# Altium schematic sheet do.SchDoc
size A2
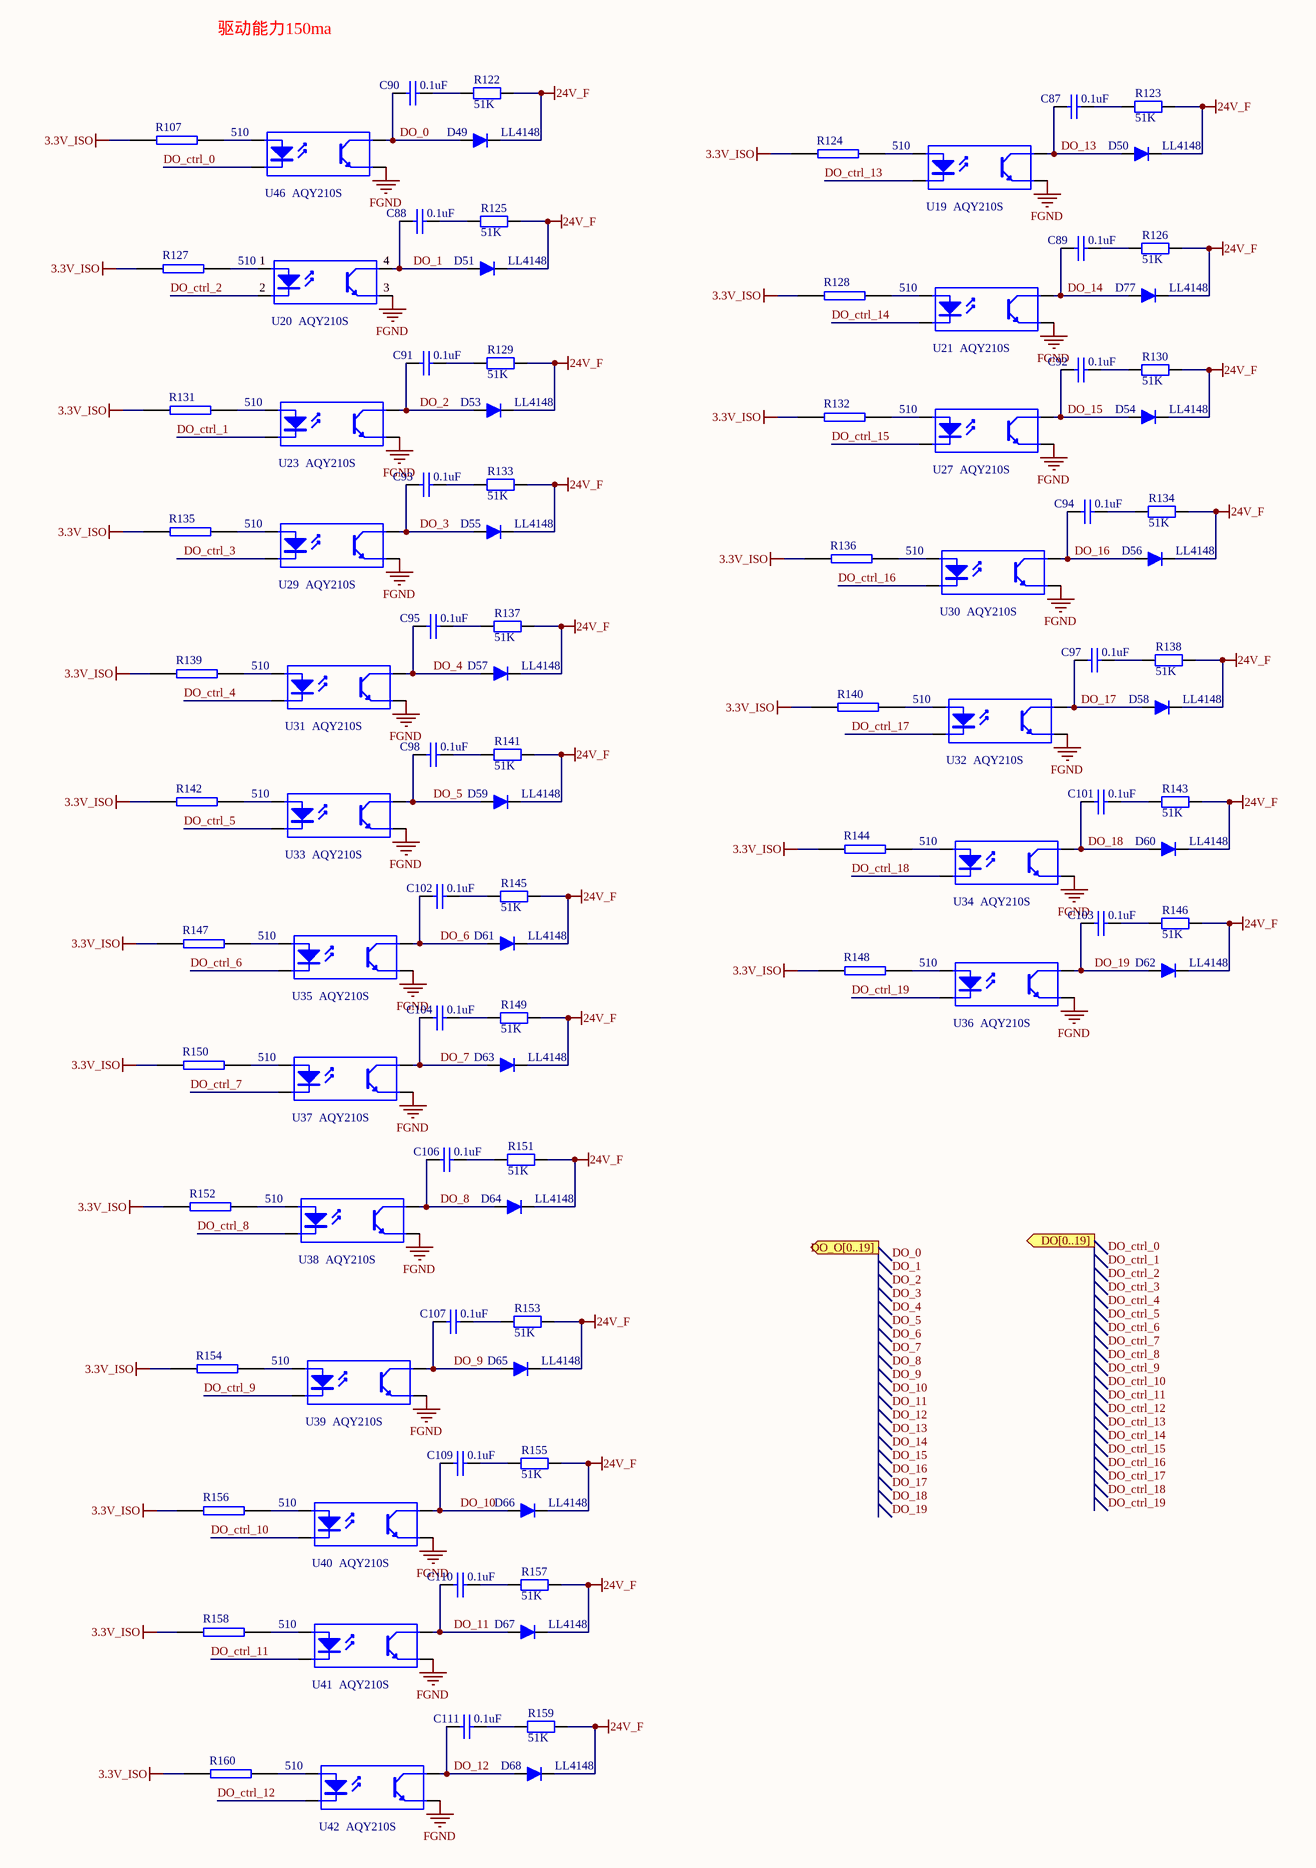
[diagram p0: do.SchDoc]

## Parts
C87  0.1uF  [0603C]
C88  0.1uF  [0603C]
C89  0.1uF  [0603C]
C90  0.1uF  [0603C]
C91  0.1uF  [0603C]
C92  0.1uF  [0603C]
C93  0.1uF  [0603C]
C94  0.1uF  [0603C]
C95  0.1uF  [0603C]
C97  0.1uF  [0603C]
C98  0.1uF  [0603C]
C101  0.1uF  [0603C]
C102  0.1uF  [0603C]
C103  0.1uF  [0603C]
C104  0.1uF  [0603C]
C106  0.1uF  [0603C]
C107  0.1uF  [0603C]
C109  0.1uF  [0603C]
C110  0.1uF  [0603C]
C111  0.1uF  [0603C]
D49  LL4148  [DO-213AB/LL34/MiniMELF]
D50  LL4148  [DO-213AB/LL34/MiniMELF]
D51  LL4148  [DO-213AB/LL34/MiniMELF]
D53  LL4148  [DO-213AB/LL34/MiniMELF]
D54  LL4148  [DO-213AB/LL34/MiniMELF]
D55  LL4148  [DO-213AB/LL34/MiniMELF]
D56  LL4148  [DO-213AB/LL34/MiniMELF]
D57  LL4148  [DO-213AB/LL34/MiniMELF]
D58  LL4148  [DO-213AB/LL34/MiniMELF]
D59  LL4148  [DO-213AB/LL34/MiniMELF]
D60  LL4148  [DO-213AB/LL34/MiniMELF]
D61  LL4148  [DO-213AB/LL34/MiniMELF]
D62  LL4148  [DO-213AB/LL34/MiniMELF]
D63  LL4148  [DO-213AB/LL34/MiniMELF]
D64  LL4148  [DO-213AB/LL34/MiniMELF]
D65  LL4148  [DO-213AB/LL34/MiniMELF]
D66  LL4148  [DO-213AB/LL34/MiniMELF]
D67  LL4148  [DO-213AB/LL34/MiniMELF]
D68  LL4148  [DO-213AB/LL34/MiniMELF]
D77  LL4148  [DO-213AB/LL34/MiniMELF]
R107  510  [0603R]
R122  51K  [0603R]
R123  51K  [0603R]
R124  510  [0603R]
R125  51K  [0603R]
R126  51K  [0603R]
R127  510  [0603R]
R128  510  [0603R]
R129  51K  [0603R]
R130  51K  [0603R]
R131  510  [0603R]
R132  510  [0603R]
R133  51K  [0603R]
R134  51K  [0603R]
R135  510  [0603R]
R136  510  [0603R]
R137  51K  [0603R]
R138  51K  [0603R]
R139  510  [0603R]
R140  510  [0603R]
R141  51K  [0603R]
R142  510  [0603R]
R143  51K  [0603R]
R144  510  [0603R]
R145  51K  [0603R]
R146  51K  [0603R]
R147  510  [0603R]
R148  510  [0603R]
R149  51K  [0603R]
R150  510  [0603R]
R151  51K  [0603R]
R152  510  [0603R]
R153  51K  [0603R]
R154  510  [0603R]
R155  51K  [0603R]
R156  510  [0603R]
R157  51K  [0603R]
R158  510  [0603R]
R159  51K  [0603R]
R160  510  [0603R]
U19  AQY210S  [sop4]
U20  AQY210S  [sop4]
U21  AQY210S  [sop4]
U23  AQY210S  [sop4]
U27  AQY210S  [sop4]
U29  AQY210S  [sop4]
U30  AQY210S  [sop4]
U31  AQY210S  [sop4]
U32  AQY210S  [sop4]
U33  AQY210S  [sop4]
U34  AQY210S  [sop4]
U35  AQY210S  [sop4]
U36  AQY210S  [sop4]
U37  AQY210S  [sop4]
U38  AQY210S  [sop4]
U39  AQY210S  [sop4]
U40  AQY210S  [sop4]
U41  AQY210S  [sop4]
U42  AQY210S  [sop4]
U46  AQY210S  [sop4]

## Ports
DO[0..19] (out), DO_O[0..19] (out)

## Nets
3.3V_ISO: R107.2 R124.2 R127.2 R128.2 R131.2 R132.2 R135.2 R136.2 R139.2 R140.2 R142.2 R144.2 R147.2 R148.2 R150.2 R152.2 R154.2 R156.2 R158.2 R160.2
24V_F: D49.1 D50.1 D51.1 D53.1 D54.1 D55.1 D56.1 D57.1 D58.1 D59.1 D60.1 D61.1 D62.1 D63.1 D64.1 D65.1 D66.1 D67.1 D68.1 D77.1 R122.2 R123.2 R125.2 R126.2 R129.2 R130.2 R133.2 R134.2 R137.2 R138.2 R141.2 R143.2 R145.2 R146.2 R149.2 R151.2 R153.2 R155.2 R157.2 R159.2
FGND: U19.3(E) U20.3(E) U21.3(E) U23.3(E) U27.3(E) U29.3(E) U30.3(E) U31.3(E) U32.3(E) U33.3(E) U34.3(E) U35.3(E) U36.3(E) U37.3(E) U38.3(E) U39.3(E) U40.3(E) U41.3(E) U42.3(E) U46.3(E)
DO_0: C90.1 D49.2 U46.4(C)
DO_1: C88.1 D51.2 U20.4(C)
DO_2: C91.1 D53.2 U23.4(C)
DO_3: C93.1 D55.2 U29.4(C)
DO_4: C95.1 D57.2 U31.4(C)
DO_5: C98.1 D59.2 U33.4(C)
DO_6: C102.1 D61.2 U35.4(C)
DO_7: C104.1 D63.2 U37.4(C)
DO_8: C106.1 D64.2 U38.4(C)
DO_9: C107.1 D65.2 U39.4(C)
DO_10: C109.1 D66.2 U40.4(C)
DO_11: C110.1 D67.2 U41.4(C)
DO_12: C111.1 D68.2 U42.4(C)
DO_13: C87.1 D50.2 U19.4(C)
DO_14: C89.1 D77.2 U21.4(C)
DO_15: C92.1 D54.2 U27.4(C)
DO_16: C94.1 D56.2 U30.4(C)
DO_17: C97.1 D58.2 U32.4(C)
DO_18: C101.1 D60.2 U34.4(C)
DO_19: C103.1 D62.2 U36.4(C)
DO_ctrl_0: U46.2(K)
DO_ctrl_1: U23.2(K)
DO_ctrl_2: U20.2(K)
DO_ctrl_3: U29.2(K)
DO_ctrl_4: U31.2(K)
DO_ctrl_5: U33.2(K)
DO_ctrl_6: U35.2(K)
DO_ctrl_7: U37.2(K)
DO_ctrl_8: U38.2(K)
DO_ctrl_9: U39.2(K)
DO_ctrl_10: U40.2(K)
DO_ctrl_11: U41.2(K)
DO_ctrl_12: U42.2(K)
DO_ctrl_13: U19.2(K)
DO_ctrl_14: U21.2(K)
DO_ctrl_15: U27.2(K)
DO_ctrl_16: U30.2(K)
DO_ctrl_17: U32.2(K)
DO_ctrl_18: U34.2(K)
DO_ctrl_19: U36.2(K)
NetC87_2: C87.2 R123.1
NetC88_2: C88.2 R125.1
NetC89_2: C89.2 R126.1
NetC90_2: C90.2 R122.1
NetC91_2: C91.2 R129.1
NetC92_2: C92.2 R130.1
NetC93_2: C93.2 R133.1
NetC94_2: C94.2 R134.1
NetC95_2: C95.2 R137.1
NetC97_2: C97.2 R138.1
NetC98_2: C98.2 R141.1
NetC101_2: C101.2 R143.1
NetC102_2: C102.2 R145.1
NetC103_2: C103.2 R146.1
NetC104_2: C104.2 R149.1
NetC106_2: C106.2 R151.1
NetC107_2: C107.2 R153.1
NetC109_2: C109.2 R155.1
NetC110_2: C110.2 R157.1
NetC111_2: C111.2 R159.1
NetR107_1: R107.1 U46.1(A)
NetR124_1: R124.1 U19.1(A)
NetR127_1: R127.1 U20.1(A)
NetR128_1: R128.1 U21.1(A)
NetR131_1: R131.1 U23.1(A)
NetR132_1: R132.1 U27.1(A)
NetR135_1: R135.1 U29.1(A)
NetR136_1: R136.1 U30.1(A)
NetR139_1: R139.1 U31.1(A)
NetR140_1: R140.1 U32.1(A)
NetR142_1: R142.1 U33.1(A)
NetR144_1: R144.1 U34.1(A)
NetR147_1: R147.1 U35.1(A)
NetR148_1: R148.1 U36.1(A)
NetR150_1: R150.1 U37.1(A)
NetR152_1: R152.1 U38.1(A)
NetR154_1: R154.1 U39.1(A)
NetR156_1: R156.1 U40.1(A)
NetR158_1: R158.1 U41.1(A)
NetR160_1: R160.1 U42.1(A)

## Notes on the sheet
- 驱动能力150ma
- Labels drawn without touching a wire or pin: DO_0, DO_1, DO_2, DO_3, DO_4, DO_5, DO_6, DO_7, DO_8, DO_9, DO_10, DO_11, DO_12, DO_13, DO_14, DO_15, DO_16, DO_17, DO_18, DO_19, DO_ctrl_0, DO_ctrl_1, DO_ctrl_2, DO_ctrl_3, DO_ctrl_4, DO_ctrl_5, DO_ctrl_6, DO_ctrl_7, DO_ctrl_8, DO_ctrl_9, DO_ctrl_10, DO_ctrl_11, DO_ctrl_12, DO_ctrl_13, DO_ctrl_14, DO_ctrl_15, DO_ctrl_16, DO_ctrl_17, DO_ctrl_18, DO_ctrl_19

## Library data of the parts
C87-C95 C97 C98 C101-C104 C106 C107 C109-C111 = CAP: Capacitor
D49-D51 D53-D68 D77 = LL4148: VISHAY,LL4148,圆柱体MiniMELF100V/2A,ROHS; 版本: V1.00; 名称: 快速开关二极管; 物料编号: APLLY; 制造商: VISHAY
R107 R124 R127 R128 R131 R132 R135 R136 R139 R140 R142 R144 R147 R148 R150 R152 R154 R156 R158 R160 = RES2
R122 R123 R125 R126 R129 R130 R133 R134 R137 R138 R141 R143 R145 R146 R149 R151 R153 R155 R157 R159 = Res0805M
U19-U21 U23 U27 U29-U42 U46 = Optoisolator1: 4-Pin Phototransistor Optocoupler; Published: 24-Mar-1999; LatestRevisionDate: 04-Mar-2005; LatestRevisionNote: Sch pins 3 & 4 Swapped.; DatasheetVersion: Nov-2003; PackageReference: DIP-4; Publisher: Altium Limited